# EAGLE design UsbDmx (EAGLE 6.5.0)
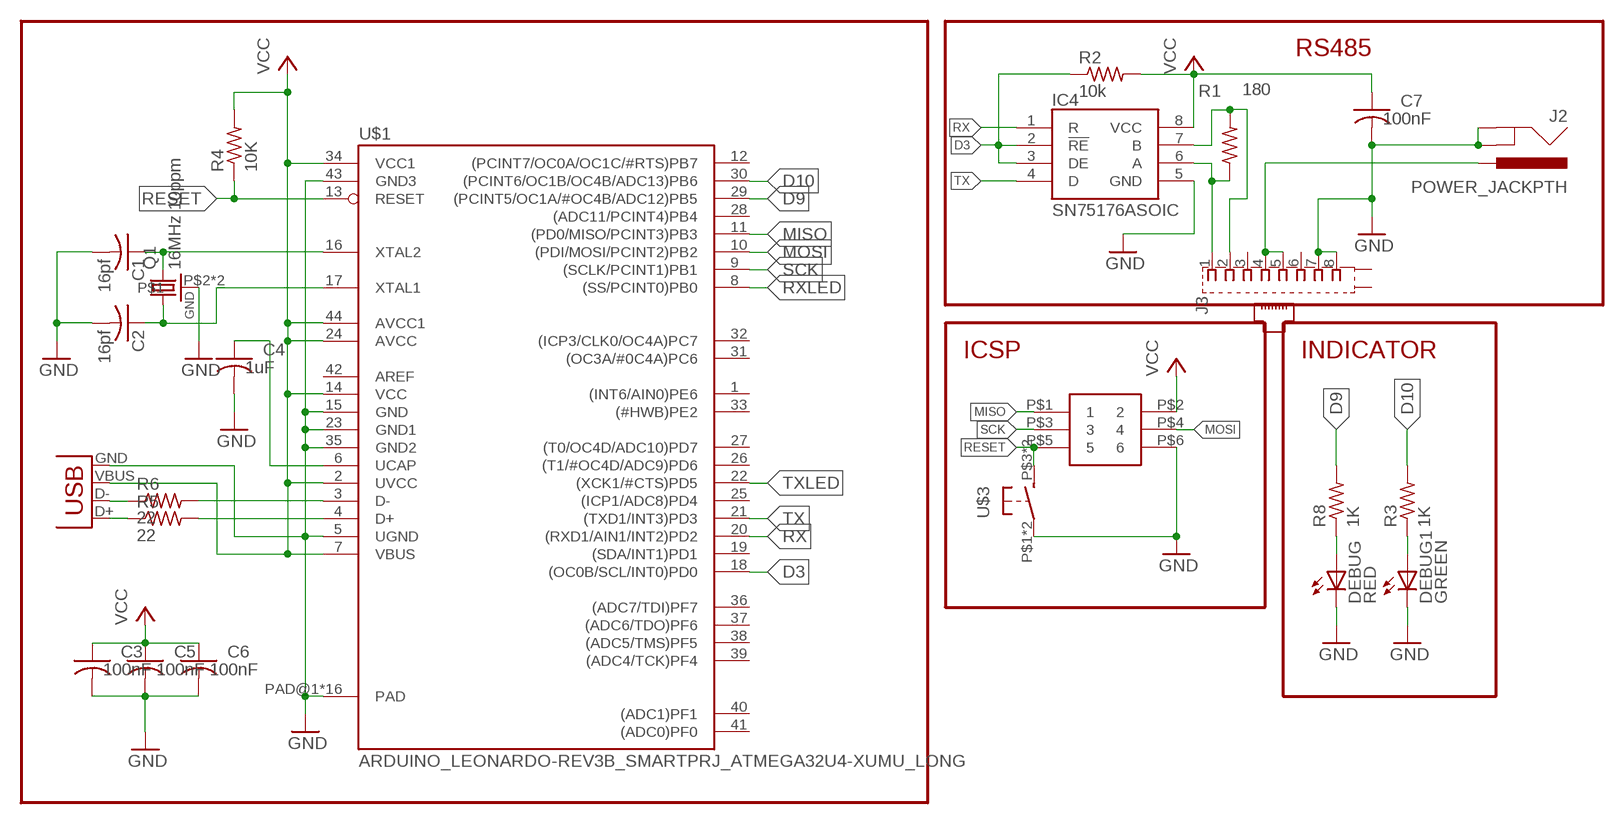
[diagram p0: schematic, sheet 1]

## Parts
C1  16pf  C-USC0603  [C0603]
C2  16pf  C-USC0603  [C0603]
C3  100nF  C-USC0603  [C0603]
C4  1uF  C-USC0603  [C0603]
C5  100nF  C-USC0603  [C0603]
C6  100nF  C-USC0603  [C0603]
C7  100nF  C-USC0603  [C0603]
DEBUG  RED  LED0805  [LED-0805]
DEBUG1  GREEN  LED0805  [LED-0805]
IC4  SN75176ASOIC  [SO08]
J2  POWER_JACKPTH  [POWER_JACK_PTH]
J3  555153-1  [555153-1]
Q1  16MHz 10ppm  CRYSTAL_4PAD2520  [CRSYTAL_2520]
R1  180  R-US_R0603  [R0603]
R2  10k  R-US_R0603  [R0603]
R3  1K  R-US_R0603  [R0603]
R4  10K  R-US_R0603  [R0603]
R5  22  R-US_R0603  [R0603]
R6  22  R-US_R0603  [R0603]
R8  1K  R-US_R0603  [R0603]
U$1  ARDUINO_LEONARDO-REV3B_SMARTPRJ_ATMEGA32U4-XUMU_LONG  [QFN44ML7X7_LONGLEADS]
U$2  2X3HEADER  [2X3HEADER]
U$3  BUTTON_MOMENTARY  [BUTTON_MOMENTARY_KMR211G]
X1  USBPTH  [USB-B-PTH]

## Nets
D3: IC4.2(!RE) IC4.3(DE) R2.1 U$1.18((OC0B/SCL/INT0)PD0)
D9: R8.2 U$1.29((PCINT5/OC1A/#OC4B/ADC12)PB5)
D10: R3.2 U$1.30((PCINT6/OC1B/OC4B/ADC13)PB6)
GND [power]: C1.2 C2.2 C3.2 C4.2 C5.2 C6.2 C7.2 DEBUG1.C DEBUG.C IC4.5(GND) J2.GND J2.GNDBREAK J3.7 J3.8 Q1.P$2 Q1.P$4 U$1.5(UGND) U$1.15(GND) U$1.23(GND1) U$1.35(GND2) U$1.43(GND3) U$1.PAD@1(PAD) U$1.PAD@2(PAD) U$1.PAD@3(PAD) U$1.PAD@4(PAD) U$1.PAD@5(PAD) U$1.PAD@6(PAD) U$1.PAD@7(PAD) U$1.PAD@8(PAD) U$1.PAD@9(PAD) U$1.PAD@10(PAD) U$1.PAD@11(PAD) U$1.PAD@12(PAD) U$1.PAD@13(PAD) U$1.PAD@14(PAD) U$1.PAD@15(PAD) U$1.PAD@16(PAD) U$2.P$6 U$3.P$1(P) U$3.P$2(P) X1.GND
MISO: U$1.11((PD0/MISO/PCINT3)PB3) U$2.P$1
MOSI: U$1.10((PDI/MOSI/PCINT2)PB2) U$2.P$4
N$1: R6.1 X1.D-
N$2: C1.1 Q1.P$3 U$1.16(XTAL2)
N$3: R5.1 X1.D+
N$4: R5.2 U$1.4(D+)
N$5: C2.1 Q1.P$1 U$1.17(XTAL1)
N$6: R6.2 U$1.3(D-)
N$7: DEBUG1.A R3.1
N$8: DEBUG.A R8.1
N$9: C4.1 U$1.6(UCAP)
RESET: R4.1 U$1.13(RESET) U$2.P$5 U$3.P$3(S) U$3.P$4(S)
RS485A: IC4.6(A) J3.1 R1.1
RS485B: IC4.7(B) J3.2 R1.2
RX: IC4.1(R) U$1.20((RXD1/AIN1/INT2)PD2)
RXLED: U$1.8((SS/PCINT0)PB0)
SCK: U$1.9((SCLK/PCINT1)PB1) U$2.P$3
TX: IC4.4(D) U$1.21((TXD1/INT3)PD3)
TXLED: U$1.22((XCK1/#CTS)PD5)
VCC: C3.1 C5.1 C6.1 C7.1 IC4.8(VCC) R2.2 R4.2 U$1.2(UVCC) U$1.7(VBUS) U$1.14(VCC) U$1.24(AVCC) U$1.34(VCC1) U$1.44(AVCC1) U$2.P$2 X1.VBUS
VMOT: J2.PWR J3.4 J3.5
Unconnected: J3.3 J3.6 J3.G1(S1) J3.G2(S2) U$1.1((INT6/AIN0)PE6) U$1.12((PCINT7/OC0A/OC1C/#RTS)PB7) U$1.19((SDA/INT1)PD1) U$1.25((ICP1/ADC8)PD4) U$1.26((T1/#OC4D/ADC9)PD6) U$1.27((T0/OC4D/ADC10)PD7) U$1.28((ADC11/PCINT4)PB4) U$1.31((OC3A/#0C4A)PC6) U$1.32((ICP3/CLK0/OC4A)PC7) U$1.33((#HWB)PE2) U$1.36((ADC7/TDI)PF7) U$1.37((ADC6/TDO)PF6) U$1.38((ADC5/TMS)PF5) U$1.39((ADC4/TCK)PF4) U$1.40((ADC1)PF1) U$1.41((ADC0)PF0)

## Notes on the sheet
- RS485
- ICSP | INDICATOR

## Power pins joined to a net without a drawn wire
AREF: U$1.42(AREF)

## Library data of the parts
C1-C7 = adafruit:C-US: CAPACITOR, American symbol
DEBUG DEBUG1 = SparkFun:LED: LEDs Standard schematic elements and footprints for 5mm, 3mm, 1206, and 0603 sized LEDs. 5mm - Spark Fun Electronics SKU : COM-00529 (and others)
IC4 = reprap:SN75176A
J2 = SparkFun:POWER_JACK: Power Jack This is the standard 5.5mm barrel jack for power. The PTH is the most common, proven, reliable, footprint. All others are experimental. The Slot footprint only works if the mill layer is transmitted to the PCB fab house so be warned. Spark Fun Electronics SKU : PRT-00119. Mating wall wart : TOL-00298 (and others)
J3 = con-amp:555153-1: AMP connector
Q1 = blinkinlabs:CRYSTAL_4PAD
R1-R6 R8 = adafruit:R-US_: RESISTOR, American symbol
U$1 = blinkinlabs:ARDUINO_LEONARDO-REV3B_SMARTPRJ_ATMEGA32U4-XU
U$2 = sonos_library:2X3HEADER
U$3 = blinkinlabs:BUTTON_MOMENTARY
X1 = SparkFun:USB: USB Connectors USB-B-PTH is fully proven SKU : PRT-00139 USB-miniB is fully proven SKU : PRT-00587 USB-A-PCB is untested. USB-A-H is throughly reviewed, but untested. Spark Fun Electronics SKU : PRT-00437 USB-B-SMT is throughly reviewed, but untested. Needs silkscreen touching up. USB-A-S has not been used/tested USB-MB-H has not been used/tested

## Net classes
0 default: width 0.254 mm
1 power: width 0.406 mm
2 motors: width 0.61 mm

## Board
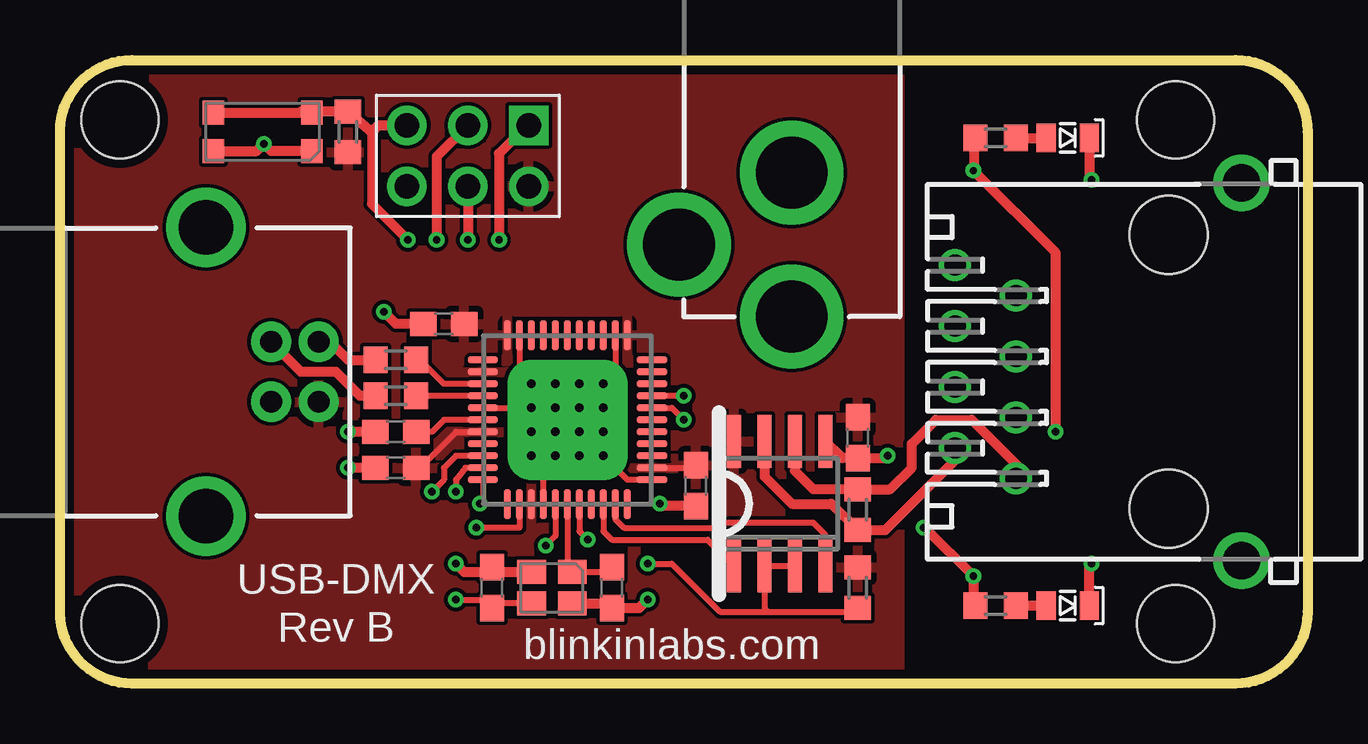
[diagram p1: board, top side]
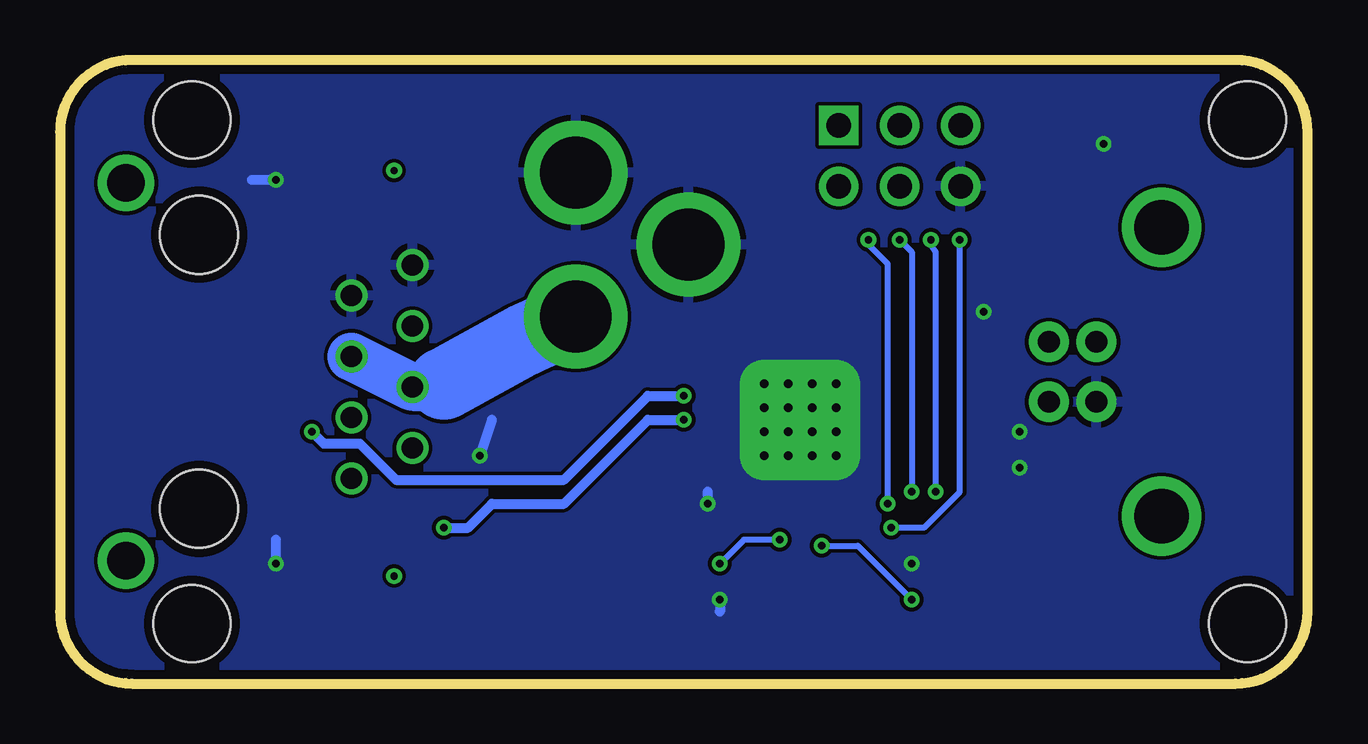
[diagram p2: board, bottom side, seen from below]

Size 52 x 26 mm. Coordinates in mm from the lower left corner, seen from the top.
Outline: 3,26 49,26 arc-90 52,23 52,3 arc-90 49,0 3,0 arc-90 0,3 0,23 arc-90 3,26
Copper layers (1*16): Top 0.0356mm / dielectric 1.5011mm / Bottom 0.0356mm
Design rules "default *": minimum track width 6mil, minimum drill 0.3mm, track to track 6mil, track to pad 6mil, pad to pad 6mil, via to via 6mil, smd to smd 6mil, copper to edge 15mil, drill to drill 6mil, minimum pad ring 7mil, minimum via ring 7mil, stop-mask expansion 4mil, vias tented up to drill 0.5mm, thermal gap 10mil
Holes 3.2 mm at 2.5,2.5 46.5,23.5 46.5,2.5 2.5,23.5

### Footprints (pad centres in the part's own frame; a part is rotated, then mirrored left to right if it is on the bottom)
C0603 = smd 1.1 x 1: 1 -0.85,0; 2 0.85,0
LED-0805 = smd 1.2 x 0.8: A 0,-0.9; C 0,0.9
SO08 = smd 0.6 x 2.2: 1 -1.905,-2.6; 2 -0.635,-2.6; 3 0.635,-2.6; 4 1.905,-2.6; 5 1.905,2.6; 6 0.635,2.6; 7 -0.635,2.6; 8 -1.905,2.6
POWER_JACK_PTH = drill 2.997 pad 4.318: GND 0,7.7; GNDBREAK 4.7,10.7; PWR 0,13.7
555153-1 = drill 0.889: 1 -4.445,6.35; 2 -3.175,8.89; 3 -1.905,6.35; 4 -0.635,8.89; 5 0.635,6.35; 6 1.905,8.89; 7 3.175,6.35; 8 4.445,8.89 | drill 1.575 pad 2.184: G1 -7.874,-3.048; G2 7.874,-3.048 | hole 3.251: -5.715,0; 5.715,0
CRSYTAL_2520 = smd 1.2 x 1: P$1 -0.85,-0.65; P$2 0.85,-0.65; P$3 0.85,0.65; P$4 -0.85,0.65
R0603 = smd 1 x 1.1: 1 -0.85,0; 2 0.85,0
QFN44ML7X7_LONGLEADS = smd 1.25 x 0.275: 1 -3.525,2.5; 2 -3.525,2; 3 -3.525,1.5; 4 -3.525,1; 5 -3.525,0.5; 6 -3.525,0; 7 -3.525,-0.5; 8 -3.525,-1; 9 -3.525,-1.5; 10 -3.525,-2; 11 -3.525,-2.5; 23 3.525,-2.5; 24 3.525,-2; 25 3.525,-1.5; 26 3.525,-1; 27 3.525,-0.5; 28 3.525,0; 29 3.525,0.5; 30 3.525,1; 31 3.525,1.5; 32 3.525,2; 33 3.525,2.5 | smd 0.275 x 1.25: 12 -2.5,-3.525; 13 -2,-3.525; 14 -1.5,-3.525; 15 -1,-3.525; 16 -0.5,-3.525; 17 0,-3.525; 18 0.5,-3.525; 19 1,-3.525; 20 1.5,-3.525; 21 2,-3.525; 22 2.5,-3.525; 34 2.5,3.525; 35 2,3.525; 36 1.5,3.525; 37 1,3.525; 38 0.5,3.525; 39 0,3.525; 40 -0.5,3.525; 41 -1,3.525; 42 -1.5,3.525; 43 -2,3.525; 44 -2.5,3.525 | drill 0.35 pad 2: PAD@1 -1.5,1.5; PAD@4 1.5,1.5; PAD@13 -1.5,-1.5; PAD@16 1.5,-1.5 | drill 0.35 pad 2 square: PAD@2 -0.5,1.5; PAD@3 0.5,1.5; PAD@5 -1.5,0.5; PAD@8 1.5,0.5; PAD@9 -1.5,-0.5; PAD@12 1.5,-0.5; PAD@14 -0.5,-1.5; PAD@15 0.5,-1.5 | drill 0.35 pad 1 square: PAD@6 -0.5,0.5; PAD@7 0.5,0.5; PAD@10 -0.5,-0.5; PAD@11 0.5,-0.5
2X3HEADER = drill 1.016 pad 1.651 square: P$1 -1.27,2.54 | drill 1.016 pad 1.651: P$2 1.27,2.54; P$3 -1.27,0; P$4 1.27,0; P$5 -1.27,-2.54; P$6 1.27,-2.54
BUTTON_MOMENTARY_KMR211G = smd 0.9 x 1: P$1 -2,0.8; P$2 2.1,0.8; P$3 -2,-0.8; P$4 2.1,-0.8
USB-B-PTH = drill 0.914 pad 1.676: D+ 0,1.25; D- 1.981,1.25; GND 0,-1.25; VBUS 1.981,-1.25 | drill 2.286: S1 -2.718,-6.02; S2 -2.718,6.02

### Placement (x,y rotation side)
C1  18,4 90 top
C2  23,4 270 top
C3  16,15 180 top
C4  14,10.5 180 top
C5  33.25,10.25 270 top
C6  14,9 180 top
C7  26.5,8.25 270 top
DEBUG  42,3.25 270 top
DEBUG1  42,22.75 270 top
IC4  30,7.5 0 top
J2  30.5,29 180 top
J3  46.2,13 90 top
Q1  20.5,4 180 top
R1  33.25,7.25 270 top
R2  33.25,4 90 top
R3  39,22.75 180 top
R4  12,23 270 top
R5  14,12 0 top
R6  14,13.5 0 top
R8  39,3.25 180 top
U$1  21.15,11 0 top
U$2  17,22 270 top
U$3  8.5,23 180 top
X1  8.8,13 0 top

### Tracks (layer width: path | path; a pad name or v marks a point on that pad's centre or on a via)
D3  (via drill 0.3)
  Top 0.254: IC4.3 IC4.2 29.36,3.13 29.5,3 | U$1.18 21.65,6.35 v22,6 | v24.5,5 25.5,5 27.5,3 29.5,3 | 29.5,3 33.1,3 R2.1
  Bottom 0.254: v22,6 23.5,6 v24.5,5
D9  (via drill 0.3)
  Top 0.254: 38.08,3.27 R8.2 | U$1.29 25.5,11.5 v26,11
  Top 0.406: 38.08,3.27 v38.08,4.48 36.06,6.5 v36,6.5
  Bottom 0.406: v36,6.5 35,6.5 34,7.5 31,7.5 27.5,11 v26,11
D10  (via drill 0.3)
  Top 0.254: 38.09,22.74 R3.2 | 38.09,21.41 v38.07,21.39 | v26,12 U$1.30
  Top 0.406: 38.09,22.74 38.09,21.41 | v41.5,10.5 41.5,17.96 v38.07,21.39
  Bottom 0.406: v41.5,10.5 41,10 39.5,10 38,8.5 31,8.5 27.5,12 v26,12
GND  (via drill 0.3)
  Top 0.254: U$1.23 23.65,8.5 U$1.PAD@16 | U$1.15 20.15,9 U$1.PAD@14 | U$1.5 U$1.PAD@5 | U$1.43 19.15,13 U$1.PAD@1 | U$1.35 23.15,13 U$1.PAD@4
  Top 0.406: U$1.PAD@1 U$1.PAD@2 U$1.PAD@6 U$1.PAD@5 | v34.5,9.5 34.4,9.4 C5.2 32.6,9.4 IC4.5 | 21.5,3.5 Q1.P$4 | C3.2 14,15 v13.5,15.5 | C4.2 v12,10.5 | C6.2 v12,9 | v16.5,5 16.85,4.65 17.8,4.65 C1.2 18.2,4.65 Q1.P$2 | 21.55,3.15 Q1.P$4 | v24.5,3.5 24.15,3.15 C2.2 22.8,3.35 Q1.P$4 | C7.2 25.1,7.4 v25,7.5 | DEBUG1.C 42.9,21.1 v43,21 | DEBUG.C 42.9,4.9 v43,5 | U$3.P$1 8.8,22.2 v8.5,22.5 8.2,22.2 U$3.P$2
  Bottom 0.406: v34.5,9.5 34,11 | v24.5,3.5 24.5,3 | v25,7.5 25,8 | v43,21 44,21 | v43,5 43,6
  pour Bottom: 0,0 52,0 52,26 0,26
MISO  (via drill 0.3)
  Top 0.254: U$1.11 17.62,7.62 v17.5,7.5
  Top 0.406: v18.3,18.5 18.3,22.1 19.47,23.27 U$2.P$1
  Bottom 0.254: v17.5,7.5 17.5,17.5 18.3,18.3 v18.3,18.5
MOSI  (via drill 0.3)
  Top 0.254: U$1.10 16.9,9 16.5,8.5 v16.5,8
  Top 0.406: U$2.P$4 v17,18.5
  Bottom 0.254: v17,18.5 16.5,18 v16.5,8
N$1
  Top 0.406: X1.D- 11.25,14.25 12,13.5 R6.1
N$2  (via drill 0.3)
  Top 0.254: U$1.16 20.65,6.15 v20.25,5.75 | 19.75,3.25 Q1.P$3 18.2,3.35 C1.1 17.65,3.5 v16.5,3.5
  Bottom 0.254: v20.25,5.75 18.75,5.75 v16.5,3.5
N$3
  Top 0.406: R5.1 12.5,12 11.5,13 10.05,13 X1.D+
N$4
  Top 0.254: U$1.4 R5.2
N$5
  Top 0.254: U$1.17 21.15,4.85 Q1.P$1 22.8,4.65 C2.1
N$6
  Top 0.254: U$1.3 16,12.5 15,13.5 R6.2
N$7
  Top 0.406: R3.1 DEBUG1.A
N$8
  Top 0.406: DEBUG.A R8.1
N$9
  Top 0.254: U$1.6 16,11 15.5,10.5 C4.1
RESET  (via drill 0.3)
  Top 0.254: U$1.13 19.15,6.5 v17.35,6.5
  Top 0.406: v14.5,18.5 13,20 13,23 | U$2.P$5 13.27,23.27 13,23 | 13,23 R4.1 10.05,23.85 U$3.P$3 U$3.P$4
  Bottom 0.254: v14.5,18.5 14.5,8 16,6.5 v17.35,6.5
RS485A
  Top 0.406: J3.1 39.85,9.15 38,11 36.5,11 35.5,10 35.5,9 34.6,8.1 R1.1 31.4,8.1 30.64,8.87 IC4.6
RS485B
  Top 0.406: IC4.7 29.36,8.63 30.5,7.5 32.15,7.5 R1.2 34.4,6.4 37.31,9.31 J3.2
RX
  Top 0.254: U$1.20 22.65,6.35 23,6 27,6 IC4.1 28,4.8 28,4.5
SCK  (via drill 0.3)
  Top 0.254: U$1.9 16.5,9.5 16,9 16,8.5 v15.5,8
  Top 0.406: U$2.P$3 15.7,21.97 v15.7,18.5
  Bottom 0.254: v15.5,8 15.5,18 15.7,18.3 v15.7,18.5
TX
  Top 0.254: IC4.4 31.91,6.2 31.4,6.7 27.5,6.7 27.3,6.5 23.5,6.5 23.15,6.85 U$1.21
VCC
  Top 0.254: U$1.44 18.65,14.26 | C6.1 15,9 16.5,10.5 U$1.7 | U$1.24 26.4,9 C7.1
  Bottom 1.016: U$2.P$2 19.5,20.69
  pour Top: 0,0 35,0 35,26 0,26
VMOT
  Bottom 1.27: 37.45,12.5 J3.4
  Bottom 1.5: 36.13,12.37 36,12.5
  Bottom 2: 36.13,12.37 J3.4 J3.5
  Bottom 3: J2.PWR 32.7,14.3 36,12.5

### Text on the board
tNames: USB-DMX | Rev B | blinkinlabs.com